# EasyEDA schematic SCH_PCB-Final_2025-01-21.json
TITLE: Sheet_1; REV: 1.0; Date: 2025-01-07; Sheet: 1/1; Drawn By: a01800096; Company: Your Company
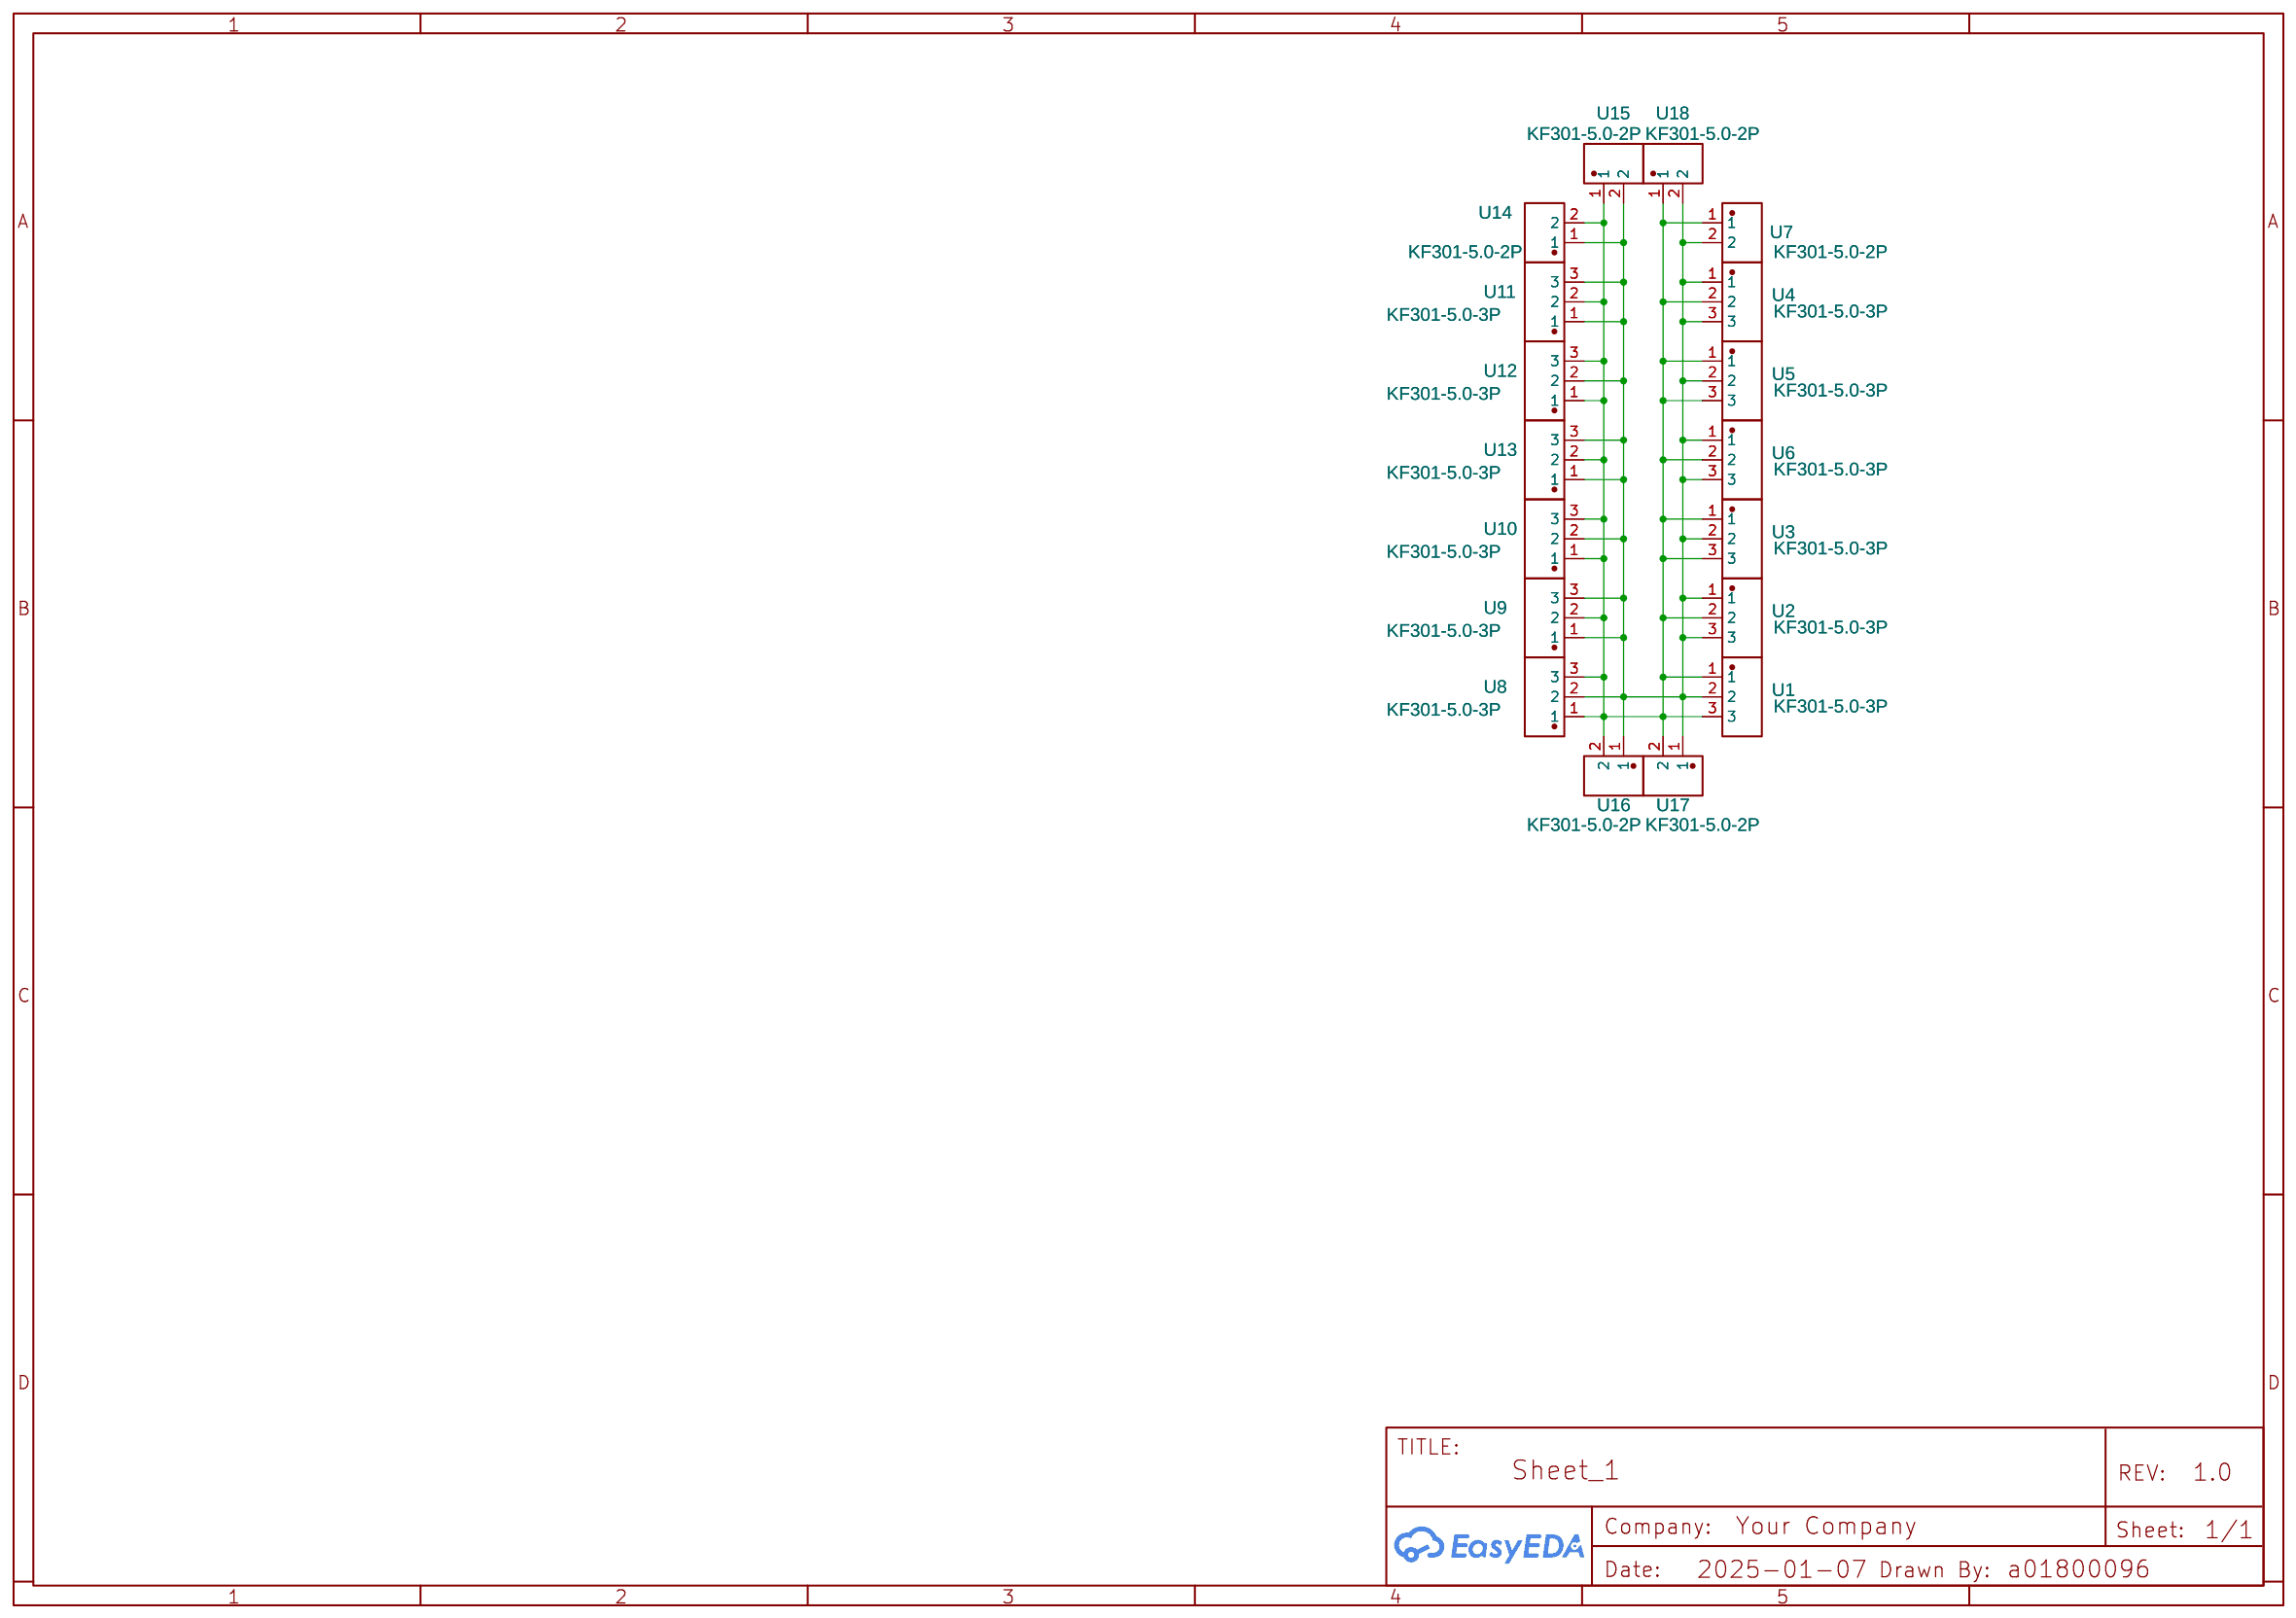
[diagram p0: schematic sheet]

## Parts
U1  KF301-5.0-3P  [CONN-TH_3P-P5.00_KF301-5.0-3P]
U2  KF301-5.0-3P  [CONN-TH_3P-P5.00_KF301-5.0-3P]
U3  KF301-5.0-3P  [CONN-TH_3P-P5.00_KF301-5.0-3P]
U4  KF301-5.0-3P  [CONN-TH_3P-P5.00_KF301-5.0-3P]
U5  KF301-5.0-3P  [CONN-TH_3P-P5.00_KF301-5.0-3P]
U6  KF301-5.0-3P  [CONN-TH_3P-P5.00_KF301-5.0-3P]
U7  KF301-5.0-2P  [CONN-TH_P5.00_KF301-5.0-2P]
U8  KF301-5.0-3P  [CONN-TH_3P-P5.00_KF301-5.0-3P]
U9  KF301-5.0-3P  [CONN-TH_3P-P5.00_KF301-5.0-3P]
U10  KF301-5.0-3P  [CONN-TH_3P-P5.00_KF301-5.0-3P]
U11  KF301-5.0-3P  [CONN-TH_3P-P5.00_KF301-5.0-3P]
U12  KF301-5.0-3P  [CONN-TH_3P-P5.00_KF301-5.0-3P]
U13  KF301-5.0-3P  [CONN-TH_3P-P5.00_KF301-5.0-3P]
U14  KF301-5.0-2P  [CONN-TH_P5.00_KF301-5.0-2P]
U15  KF301-5.0-2P  [CONN-TH_P5.00_KF301-5.0-2P]
U16  KF301-5.0-2P  [CONN-TH_P5.00_KF301-5.0-2P]
U17  KF301-5.0-2P  [CONN-TH_P5.00_KF301-5.0-2P]
U18  KF301-5.0-2P  [CONN-TH_P5.00_KF301-5.0-2P]

## Library data of the parts
U1-U6 U8-U13 = KF301-5.0-3P: Contributor: LCSC; Supplier: LCSC; Supplier Part: C474882; Manufacturer: KEFA(科发); JLCPCB Part Class: Extended Part
U7 U14-U18 = KF301-5.0-2P: Contributor: LCSC; Supplier: LCSC; Supplier Part: C474881; Manufacturer: KEFA(科发); JLCPCB Part Class: Extended Part

## Nets
Net-(U1-1): U1.1 U1.3 U2.2 U3.1 U3.3 U4.2 U5.1 U5.3 U6.2 U7.1 U8.1 U8.3 U9.2 U10.1 U10.3 U11.2 U12.1 U12.3 U13.2 U14.2 U15.1 U16.2 U17.2 U18.1
Net-(U1-2): U1.2 U2.1 U2.3 U3.2 U4.1 U4.3 U5.2 U6.1 U6.3 U7.2 U8.2 U9.1 U9.3 U10.2 U11.1 U11.3 U12.2 U13.1 U13.3 U14.1 U15.2 U16.1 U17.1 U18.2
